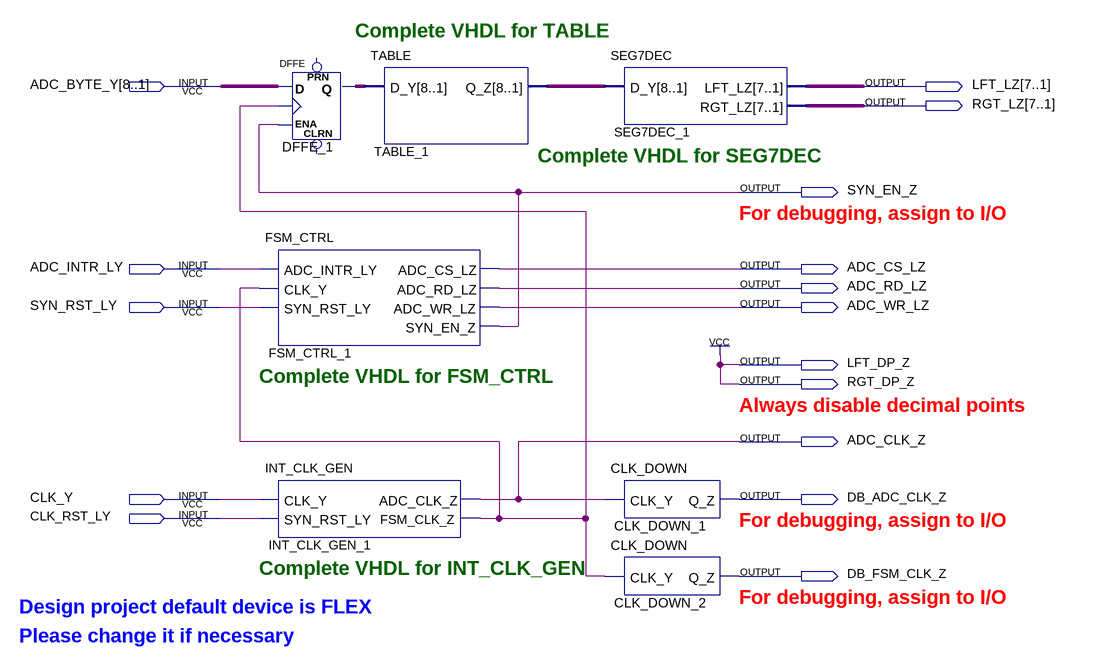
[diagram p0: schematic sheet]
// Quartus schematic design8template.bdf as structural Verilog: 7 symbols, 16 pins
module design8template (
  input  [8:1] ADC_BYTE_Y,
  input  ADC_INTR_LY,
  input  SYN_RST_LY,
  input  CLK_Y,
  input  CLK_RST_LY,
  output [7:1] LFT_LZ,
  output [7:1] RGT_LZ,
  output SYN_EN_Z,
  output ADC_CS_LZ,
  output ADC_RD_LZ,
  output ADC_WR_LZ,
  output LFT_DP_Z,
  output RGT_DP_Z,
  output ADC_CLK_Z,
  output DB_ADC_CLK_Z,
  output DB_FSM_CLK_Z
);

  wire INT_CLK_GEN_1_fsm_clk_z;
  wire [7:0] DFFE_1_q, TABLE_1_q_z;

  DFFE DFFE_1[7:0] (.D(ADC_BYTE_Y), .CLK(INT_CLK_GEN_1_fsm_clk_z), .ENA(SYN_EN_Z), .Q(DFFE_1_q));  // open: PRN, CLRN
  FSM_CTRL FSM_CTRL_1 (
    .ADC_INTR_LY(ADC_INTR_LY), .CLK_Y(INT_CLK_GEN_1_fsm_clk_z), .SYN_RST_LY(SYN_RST_LY),
    .ADC_CS_LZ(ADC_CS_LZ), .ADC_RD_LZ(ADC_RD_LZ), .ADC_WR_LZ(ADC_WR_LZ), .SYN_EN_Z(SYN_EN_Z));
  INT_CLK_GEN INT_CLK_GEN_1 (
    .CLK_Y(CLK_Y), .SYN_RST_LY(CLK_RST_LY), .ADC_CLK_Z(ADC_CLK_Z), .FSM_CLK_Z(INT_CLK_GEN_1_fsm_clk_z));
  TABLE TABLE_1 (.D_Y(DFFE_1_q), .Q_Z(TABLE_1_q_z));
  SEG7DEC SEG7DEC_1 (.D_Y(TABLE_1_q_z), .LFT_LZ(LFT_LZ), .RGT_LZ(RGT_LZ));
  CLK_DOWN CLK_DOWN_1 (.CLK_Y(ADC_CLK_Z), .Q_Z(DB_ADC_CLK_Z));
  CLK_DOWN CLK_DOWN_2 (.CLK_Y(INT_CLK_GEN_1_fsm_clk_z), .Q_Z(DB_FSM_CLK_Z));

  assign LFT_DP_Z = 1'b1;
  assign RGT_DP_Z = 1'b1;

  // Notes on the sheet:
  //   Complete VHDL for TABLE
  //   Complete VHDL for SEG7DEC
  //   For debugging, assign to I/O
  //   Complete VHDL for FSM_CTRL
  //   Always disable decimal points
  //   For debugging, assign to I/O
  //   Complete VHDL for INT_CLK_GEN
  //   For debugging, assign to I/O
  //   Design project default device is FLEX
  //   Please change it if necessary
endmodule
